# EAGLE design TeensyPedal (EAGLE 9.6.0)
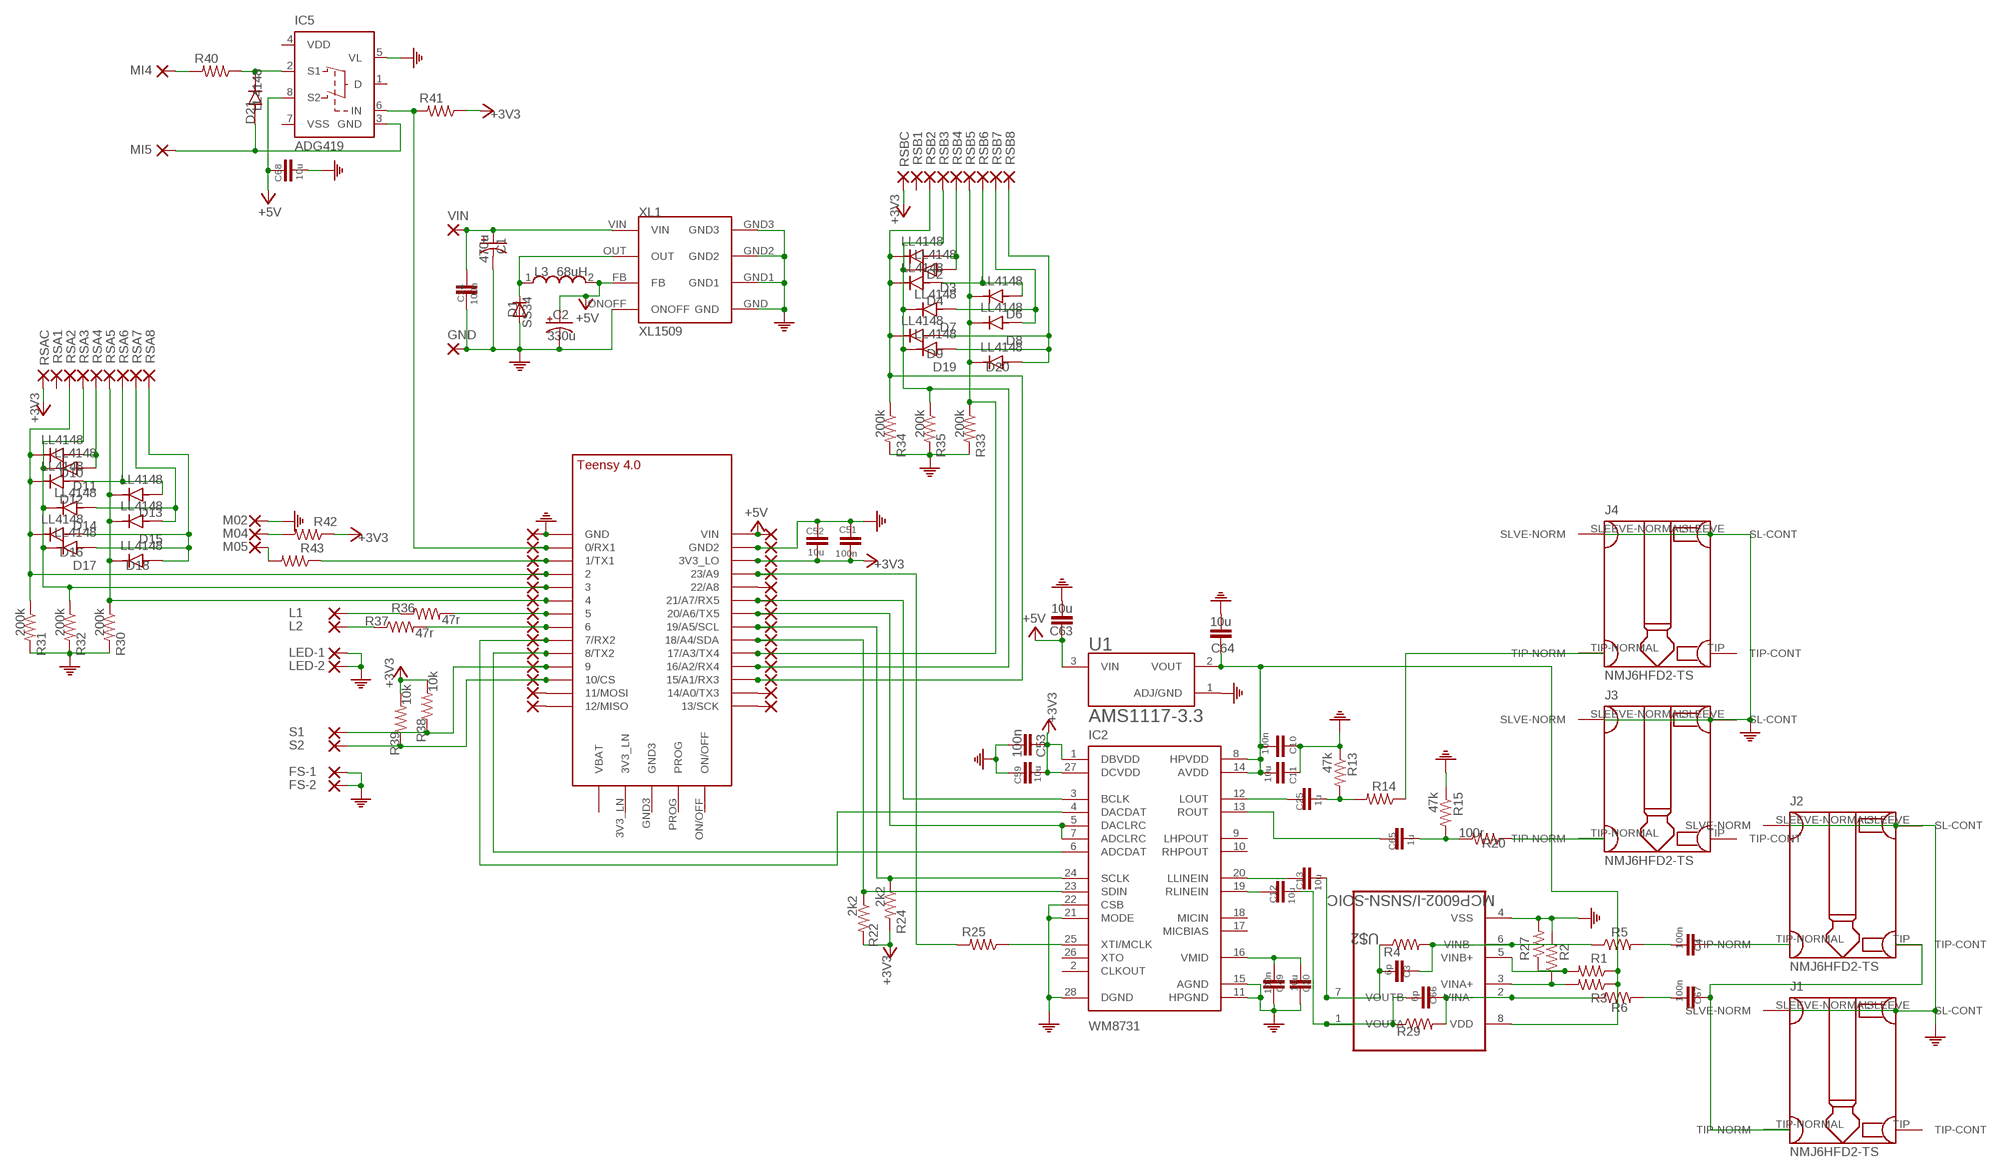
[diagram p0: schematic, sheet 1]

## Parts
+5V  1,6/0,9  [1,6/0,9]
C1  470u  CPOL-USB45181B  [B45181B]
C2  330u  CPOL-USB45181B  [B45181B]
C3  6p  C-EUC0603  [C0603]
C4  100n  C-EUC0603  [C0603]
C10  100n  C-EUC0603  [C0603]
C11  10u  C-EUC0805  [C0805]
C12  10u  C-EUC0805  [C0805]
C13  10u  C-EUC0805  [C0805]
C14  100n  C-EUC0603  [C0603]
C25  1u  C-EUC0603  [C0603]
C30  10u  C-EUC0805  [C0805]
C49  100n  C-EUC0603  [C0603]
C51  100n  C-EUC0603  [C0603]
C52  10u  C-EUC0805  [C0805]
C53  100n  C-EUC0603  [C0603]
C59  10u  C-EUC0805  [C0805]
C63  10u  C-EUC0805  [C0805]
C64  10u  C-EUC0805  [C0805]
C65  1u  C-EUC0603  [C0603]
C66  6p  C-EUC0603  [C0603]
C67  100n  C-EUC0603  [C0603]
C68  10u  C-EUC0805  [C0805]
D1  SS34  DIODE-DO214AC  [DO214AC]
D2  LL4148  [DIO_LL4148]
D3  LL4148  [DIO_LL4148]
D4  LL4148  [DIO_LL4148]
D6  LL4148  [DIO_LL4148]
D7  LL4148  [DIO_LL4148]
D8  LL4148  [DIO_LL4148]
D9  LL4148  [DIO_LL4148]
D10  LL4148  [DIO_LL4148]
D11  LL4148  [DIO_LL4148]
D12  LL4148  [DIO_LL4148]
D13  LL4148  [DIO_LL4148]
D14  LL4148  [DIO_LL4148]
D15  LL4148  [DIO_LL4148]
D16  LL4148  [DIO_LL4148]
D17  LL4148  [DIO_LL4148]
D18  LL4148  [DIO_LL4148]
D19  LL4148  [DIO_LL4148]
D20  LL4148  [DIO_LL4148]
D21  LL4148  [DIO_LL4148]
FS-1  1,6/0,9  [1,6/0,9]
FS-2  1,6/0,9  [1,6/0,9]
GND  1,6/0,9  [1,6/0,9]
GND10  2,15/1,0  [2,15/1,0]
IC2  WM8731  [SSOP28]
IC5  ADG419  [DIL08]
J1  NMJ6HFD2-TS  [NMJ6HFD2-TS]
J2  NMJ6HFD2-TS  [NMJ6HFD2-TS]
J3  NMJ6HFD2-TS  [NMJ6HFD2-TS]
J4  NMJ6HFD2-TS  [NMJ6HFD2-TS]
L1  1,6/0,9  [1,6/0,9]
L2  1,6/0,9  [1,6/0,9]
L3  68uH  WE-PD_1260/1245/1280/1210  [WE-PD_1260/1245/1280/1210]
LED-1  1,6/0,9  [1,6/0,9]
LED-2  1,6/0,9  [1,6/0,9]
M02  2,15/1,0  [2,15/1,0]
M04  2,15/1,0  [2,15/1,0]
M05  2,15/1,0  [2,15/1,0]
MI4  2,15/1,0  [2,15/1,0]
MI5  2,15/1,0  [2,15/1,0]
PIN  1,6/0,9  [1,6/0,9]
PIN1  1,6/0,9  [1,6/0,9]
PIN2  1,6/0,9  [1,6/0,9]
PIN3  1,6/0,9  [1,6/0,9]
PIN4  1,6/0,9  [1,6/0,9]
PIN5  1,6/0,9  [1,6/0,9]
PIN6  1,6/0,9  [1,6/0,9]
PIN7  1,6/0,9  [1,6/0,9]
PIN8  1,6/0,9  [1,6/0,9]
PIN9  1,6/0,9  [1,6/0,9]
PIN10  1,6/0,9  [1,6/0,9]
PIN11  1,6/0,9  [1,6/0,9]
PIN12  1,6/0,9  [1,6/0,9]
PIN13  1,6/0,9  [1,6/0,9]
PIN14  1,6/0,9  [1,6/0,9]
PIN15  1,6/0,9  [1,6/0,9]
PIN16  1,6/0,9  [1,6/0,9]
PIN17  1,6/0,9  [1,6/0,9]
PIN18  1,6/0,9  [1,6/0,9]
PIN19  1,6/0,9  [1,6/0,9]
PIN20  1,6/0,9  [1,6/0,9]
PIN21  1,6/0,9  [1,6/0,9]
PIN22  1,6/0,9  [1,6/0,9]
PIN23  1,6/0,9  [1,6/0,9]
PIN24  1,6/0,9  [1,6/0,9]
PIN25  1,6/0,9  [1,6/0,9]
R1  200k  R-US_R0603  [R0603]
R2  200k  R-US_R0603  [R0603]
R3  200k  R-US_R0603  [R0603]
R4  1m  R-US_0204/7  [0204/7]
R5  1m  R-US_R0603  [R0603]
R6  1m  R-US_R0603  [R0603]
R13  47k  R-US_R0603  [R0603]
R14  100r  R-US_R0603  [R0603]
R15  47k  R-US_R0603  [R0603]
R20  100r  R-US_R0603  [R0603]
R22  2k2  R-US_R0603  [R0603]
R24  2k2  R-US_R0603  [R0603]
R25  220r  R-US_R0603  [R0603]
R27  200k  R-US_R0603  [R0603]
R29  1m  R-US_0204/7  [0204/7]
R30  200k  R-US_R0603  [R0603]
R31  200k  R-US_R0603  [R0603]
R32  200k  R-US_R0603  [R0603]
R33  200k  R-US_R0603  [R0603]
R34  200k  R-US_R0603  [R0603]
R35  200k  R-US_R0603  [R0603]
R36  47r  R-US_R0603  [R0603]
R37  47r  R-US_R0603  [R0603]
R38  10k  R-US_R0603  [R0603]
R39  10k  R-US_R0603  [R0603]
R40  220r  R-US_R0603  [R0603]
R41  470r  R-US_R0603  [R0603]
R42  47r  R-US_R0603  [R0603]
R43  47r  R-US_R0603  [R0603]
RSA1  2,15/1,0  [2,15/1,0]
RSA2  2,15/1,0  [2,15/1,0]
RSA3  2,15/1,0  [2,15/1,0]
RSA4  2,15/1,0  [2,15/1,0]
RSA5  2,15/1,0  [2,15/1,0]
RSA6  2,15/1,0  [2,15/1,0]
RSA7  2,15/1,0  [2,15/1,0]
RSA8  2,15/1,0  [2,15/1,0]
RSAC  2,15/1,0  [2,15/1,0]
RSB1  2,54/1,1  [2,54/1,1]
RSB2  2,15/1,0  [2,15/1,0]
RSB3  2,15/1,0  [2,15/1,0]
RSB4  2,15/1,0  [2,15/1,0]
RSB5  2,15/1,0  [2,15/1,0]
RSB6  2,15/1,0  [2,15/1,0]
RSB7  2,15/1,0  [2,15/1,0]
RSB8  2,15/1,0  [2,15/1,0]
RSBC  2,15/1,0  [2,15/1,0]
S1  1,6/0,9  [1,6/0,9]
S2  1,6/0,9  [1,6/0,9]
U1  AMS1117-3.3  [SOT229P700X180-4N]
U$1  TEENSY_4.0  [TEENSY_4.0]
U$2  MCP6002-I/SNSN-SOIC  [SOIC127P690X150-8N]
VIN  2,15/1,0  [2,15/1,0]
XL1  XL1509  [XL1509]

## Nets
3V3_ANA1: C10.1 C11.1 C64.1 IC2.8(HPVDD) IC2.14(AVDD) R1.1 R3.1 U1.2(VOUT) U$2.8(VDD)
+3V3: C51.1 C52.2 C53.1 C59.2 IC2.1(DBVDD) IC2.27(DCVDD) PIN24.1(P) R22.2 R24.2 R38.2 R39.2 R41.1 R42.1 RSAC.1(P) RSBC.1(P) U$1.3V3_LO
+5V: +5V.1(P) C2.+ C63.1 C68.1 IC5.8(S2) L3.2 U1.3(VIN) U$1.VIN XL1.FB
N$1: D1.C L3.1 XL1.OUT
N$2: C30.2 C49.2 IC2.16(VMID)
N$3: IC2.24(SCLK) PIN19.1(P) R24.1 U$1.19/A5/SCL
N$4: IC2.23(SDIN) PIN18.1(P) R22.1 U$1.18/A4/SDA
N$5: C4.2 J2.TIP-NORMAL(TIP-NORM)
N$6: R1.2 R27.1 U$2.5(VINB+)
N$9: C4.1 R5.2
N$10: C12.1 C66.1 R29.1 U$2.1(VOUTA)
N$11: R2.1 R3.2 U$2.3(VINA+)
N$12: C3.2 R4.2 R5.1 U$2.6(VINB-)
N$13: C66.2 R6.1 R29.2 U$2.2(VINA-)
N$14: C3.1 C13.1 R4.1 U$2.7(VOUTB)
N$15: C67.1 R6.2
N$16: C67.2 J1.TIP-NORMAL(TIP-NORM) J2.TIP(TIP-CONT)
N$17: PIN13.1(P) U$1.13/SCK
N$18: IC2.5(DACLRC) IC2.7(ADCLRC) PIN20.1(P) U$1.20/A6(20/A6/TX5)
N$19: PIN14.1(P) U$1.14/A0(14/A0/TX3)
N$22: C25.1 R13.2 R14.2
N$23: C25.2 IC2.12(LOUT)
N$24: J4.TIP-NORMAL(TIP-NORM) R14.1
N$25: C65.1 R15.2 R20.2
N$26: J3.TIP-NORMAL(TIP-NORM) R20.1
N$28: C65.2 IC2.13(ROUT)
N$29: IC2.4(DACDAT) PIN7.1(P) U$1.7(7/RX2)
N$30: IC2.6(ADCDAT) PIN8.1(P) U$1.8(8/TX2)
N$31: IC2.3(BCLK) PIN21.1(P) U$1.21/A7(21/A7/RX5)
N$32: PIN23.1(P) R25.2 U$1.23/A9
N$33: IC2.25(XTI/MCLK) R25.1
N$43: C13.2 IC2.20(LLINEIN)
N$44: D10.A D11.A RSA4.1(P)
N$45: C12.2 IC2.19(RLINEIN)
N$47: D12.A D13.A RSA6.1(P)
N$48: D14.A D15.A RSA7.1(P)
N$49: D16.A D17.A D18.A RSA8.1(P)
N$50: IC5.6(IN) PIN.1(P) R41.2 U$1.0/RX(0/RX1)
N$51: PIN1.1(P) R43.1 U$1.1/TX(1/TX1)
N$52: PIN5.1(P) R36.2 U$1.5
N$55: PIN6.1(P) R37.2 U$1.6
N$56: D21.C IC5.2(S1) R40.1
N$57: D21.A IC5.3(GND) MI5.1(P)
N$58: PIN11.1(P) U$1.11/MOSI
N$59: PIN12.1(P) U$1.12/MISO
N$60: L1.1(P) R36.1
N$61: L2.1(P) R37.1
N$62: MI4.1(P) R40.2
N$65: PIN22.1(P) U$1.22/A8
N$66: D2.A D3.A RSB4.1(P)
N$67: D4.A D6.A RSB6.1(P)
N$68: D7.A D8.A RSB7.1(P)
N$69: D9.A D19.A D20.A RSB8.1(P)
N$70: PIN9.1(P) R38.1 S1.1(P) U$1.9/CS
N$71: PIN10.1(P) R39.1 S2.1(P) U$1.10/CS
N$72: M04.1(P) R42.2
N$73: M05.1(P) R43.2
PE: C1.- C2.- C10.2 C11.2 C14.1 C30.1 C49.1 C51.2 C52.1 C53.2 C59.1 C63.2 C64.2 C68.2 D1.A FS-1.1(P) FS-2.1(P) GND10.1(P) GND.1(P) IC2.11(HPGND) IC2.15(AGND) IC2.21(MODE) IC2.22(CSB) IC2.28(DGND) IC5.5(VL) J1.SLEEVE(SL-CONT) J1.SLEEVE-NORMAL(SLVE-NORM) J2.SLEEVE(SL-CONT) J2.SLEEVE-NORMAL(SLVE-NORM) J3.SLEEVE(SL-CONT) J3.SLEEVE-NORMAL(SLVE-NORM) J4.SLEEVE(SL-CONT) J4.SLEEVE-NORMAL(SLVE-NORM) LED-1.1(P) LED-2.1(P) M02.1(P) PIN25.1(P) R2.2 R13.1 R15.1 R27.2 R30.2 R31.2 R32.2 R33.2 R34.2 R35.2 U1.1(ADJ/GND) U$1.GND U$1.GND2 U$2.4(VSS) XL1.GND XL1.GND1 XL1.GND2 XL1.GND3 XL1.ONOFF
RSW1: D10.C D12.C D16.C PIN2.1(P) R31.1 RSA2.1(P) U$1.2
RSW2: D11.C D14.C D17.C PIN3.1(P) R32.1 RSA3.1(P) U$1.3/CANTX
RSW3: D13.C D15.C D18.C PIN4.1(P) R30.1 RSA5.1(P) U$1.4/CANRX
RSW4: D6.C D8.C D20.C PIN17.1(P) R33.1 RSB5.1(P) U$1.17/A3(17/A3/TX4)
RSW5: D3.C D7.C D19.C PIN16.1(P) R35.1 RSB3.1(P) U$1.16/A2(16/A2/RX4)
RSW6: D2.C D4.C D9.C PIN15.1(P) R34.1 RSB2.1(P) U$1.15/A1(15/A1/RX3)
VIN: C1.+ C14.2 VIN.1(P) XL1.VIN
Unconnected: IC2.2(CLKOUT) IC2.9(LHPOUT) IC2.10(RHPOUT) IC2.17(MICBIAS) IC2.18(MICIN) IC2.26(XTO) IC5.1(D) J1.TIP(TIP-CONT) J3.TIP(TIP-CONT) J4.TIP(TIP-CONT) RSA1.1(P) RSB1.1(P) U$1.3V3_LN U$1.GND3 U$1.ON/OFF U$1.PROG U$1.VBAT\(VBAT)

## Power pins joined to a net without a drawn wire
VDD: IC5.4(VDD)
VSS: IC5.7(VSS)

## Library data of the parts
+5V FS-1 FS-2 GND L1 L2 LED-1 LED-2 PIN PIN1-PIN25 S1 S2 = wirepad:1,6/0,9: THROUGH-HOLE PAD
C1 C2 = rcl:CPOL-US: POLARIZED CAPACITOR, American symbol; SPICEPREFIX: C
C3 C4 C10-C14 C25 C30 C49 C51-C53 C59 C63-C68 = rcl:C-EU: CAPACITOR, European symbol
D1 = diode:DIODE-: DIODE
D2-D4 D6-D21 = LL4148:LL4148: Surface Mount Switching Glass; AVAILABILITY: Unavailable; DESCRIPTION: Diode Standard 100V 200mA Surface Mount SOD-80; MF: ON Semiconductor; MP: LL4148; PACKAGE: SOD-80 Taitron; PRICE: None
GND10 M02 M04 M05 MI4 MI5 RSA1-RSA8 RSAC RSB2-RSB8 RSBC VIN = wirepad:2,15/1,0: THROUGH-HOLE PAD
IC2 = og-dac:WM8731
IC5 = analog-devices:ADG419: LC²MOS Precision Mini-DIP Analog switch Source: http://www.analog.com/UploadedFiles/Data_Sheets/ADG419.pdf; MF: ALTERA CORPORATION; MPN: ADG419BN; OC_FARNELL: 1438705; OC_NEWARK: 16F6524
J1-J4 = NMJ6HFD2:NMJ6HFD2-TS
L3 = Wurth_Elektronik_Passive_rev15e:WE-PD: SMD Shielded Power Inductor Characteristics Magnetically shielded version which results in a low leakage field High Saturation currents up to 25 A Very low self-losses at high switching frequency‘s Wide inductances spectrum available at all sizes Operating temperature: –40 °C to +125 °C Applications Perfectly suitable for switching regulators with extremely high efficiency Integrated DC/DC- converter Switching regulators with low operating voltages (Graphic cards, embedded PC-Cards, Mainboards) Plastic base: Because of the one piece construction these are more suitable for high vibration or shock applications <http://katalog.we-online.de/media/images/eisos/FePBF_pf2.jpg> Details see: http://katalog.we-online.de/en/pbs/WE-PD? Updated by Dan Xu 2014-07-08 2014 (C) Wurth Elektronik
R1-R6 R13-R15 R20 R22 R24 R25 R27 R29-R43 = rcl:R-US_: RESISTOR, American symbol
RSB1 = wirepad:2,54/1,1: THROUGH-HOLE PAD
U1 = AMS1117-3.3:AMS1117-3.3: Sot223/Pkg 1-Amp 3.3-Volt Low Drop Out Voltage Regulatator; AVAILABILITY: Unavailable; DESCRIPTION: Sot223/Pkg 1-Amp 3.3-Volt Low Drop Out Voltage Regulatator; MF: Advanced Monolithic Systems; MP: AMS1117-3.3; PACKAGE: None; PRICE: None
U$1 = TEENSY 4.0:TEENSY_4.0
U$2 = MCP6002-I_MS:MCP6002-I/SN: Low-Power Op Amp Check prices <https://pricing.snapeda.com/parts/MCP6002-I/MS/Microchip/view-part?ref=eda>
XL1 = XL1509:XL1509

## Net classes
3 vcc: width 0.508 mm, drill 0.61 mm, clearance 0.254 mm

## Board
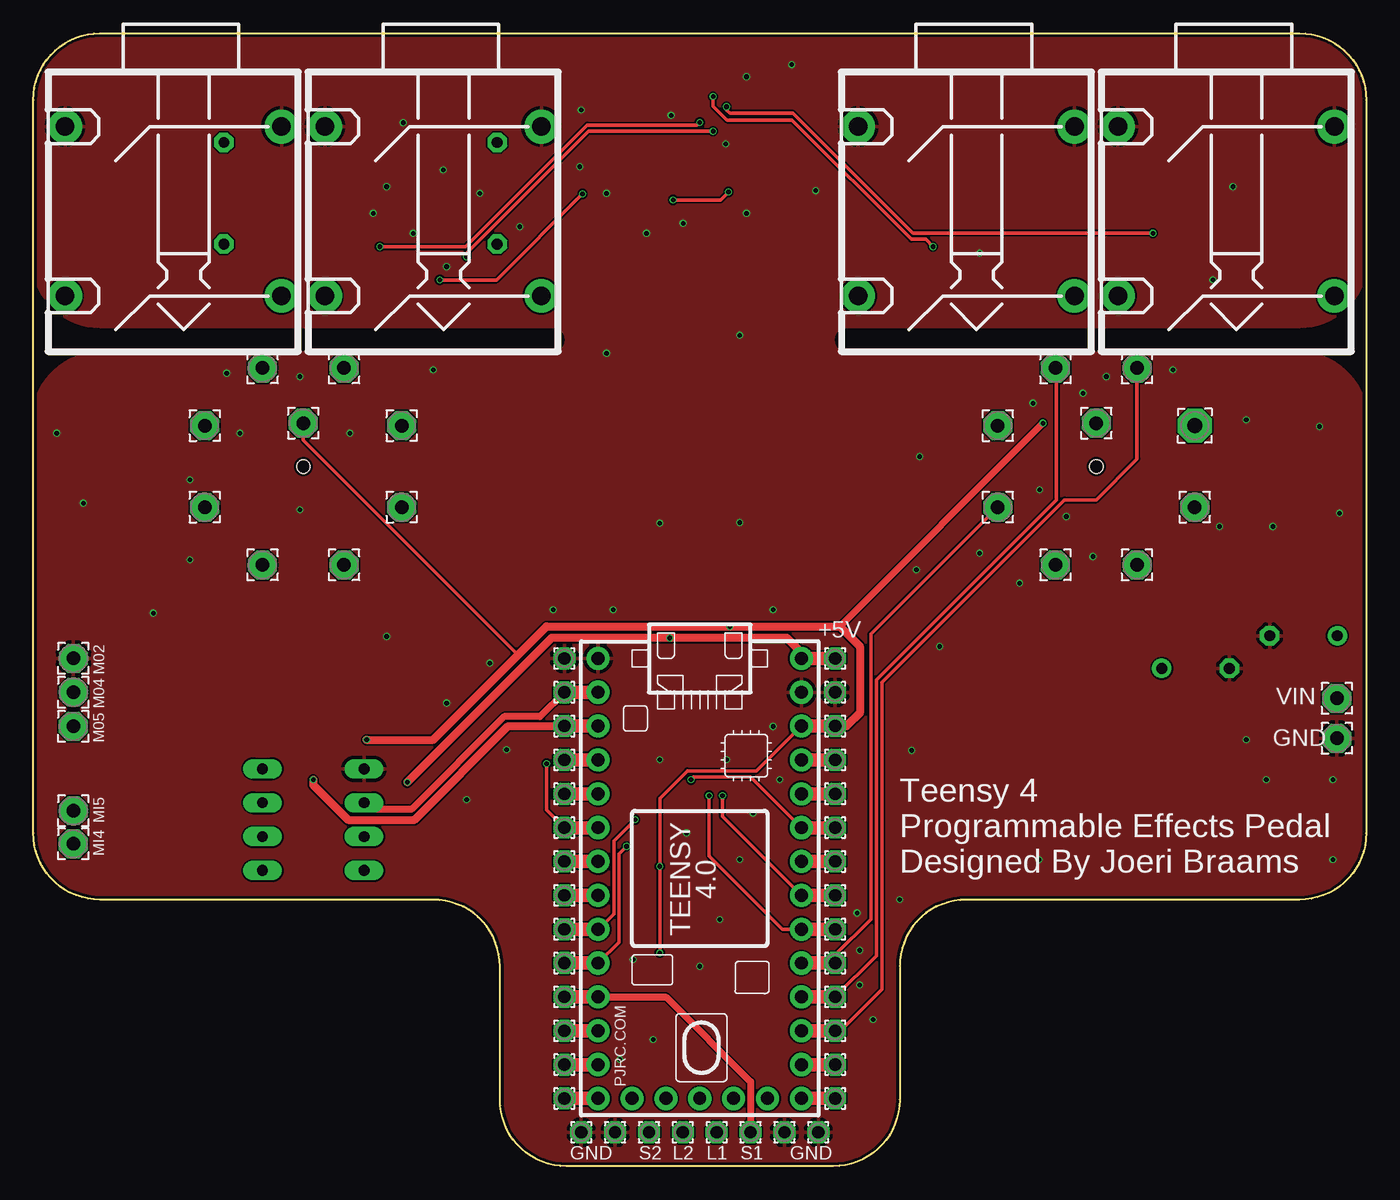
[diagram p1: board, top side]
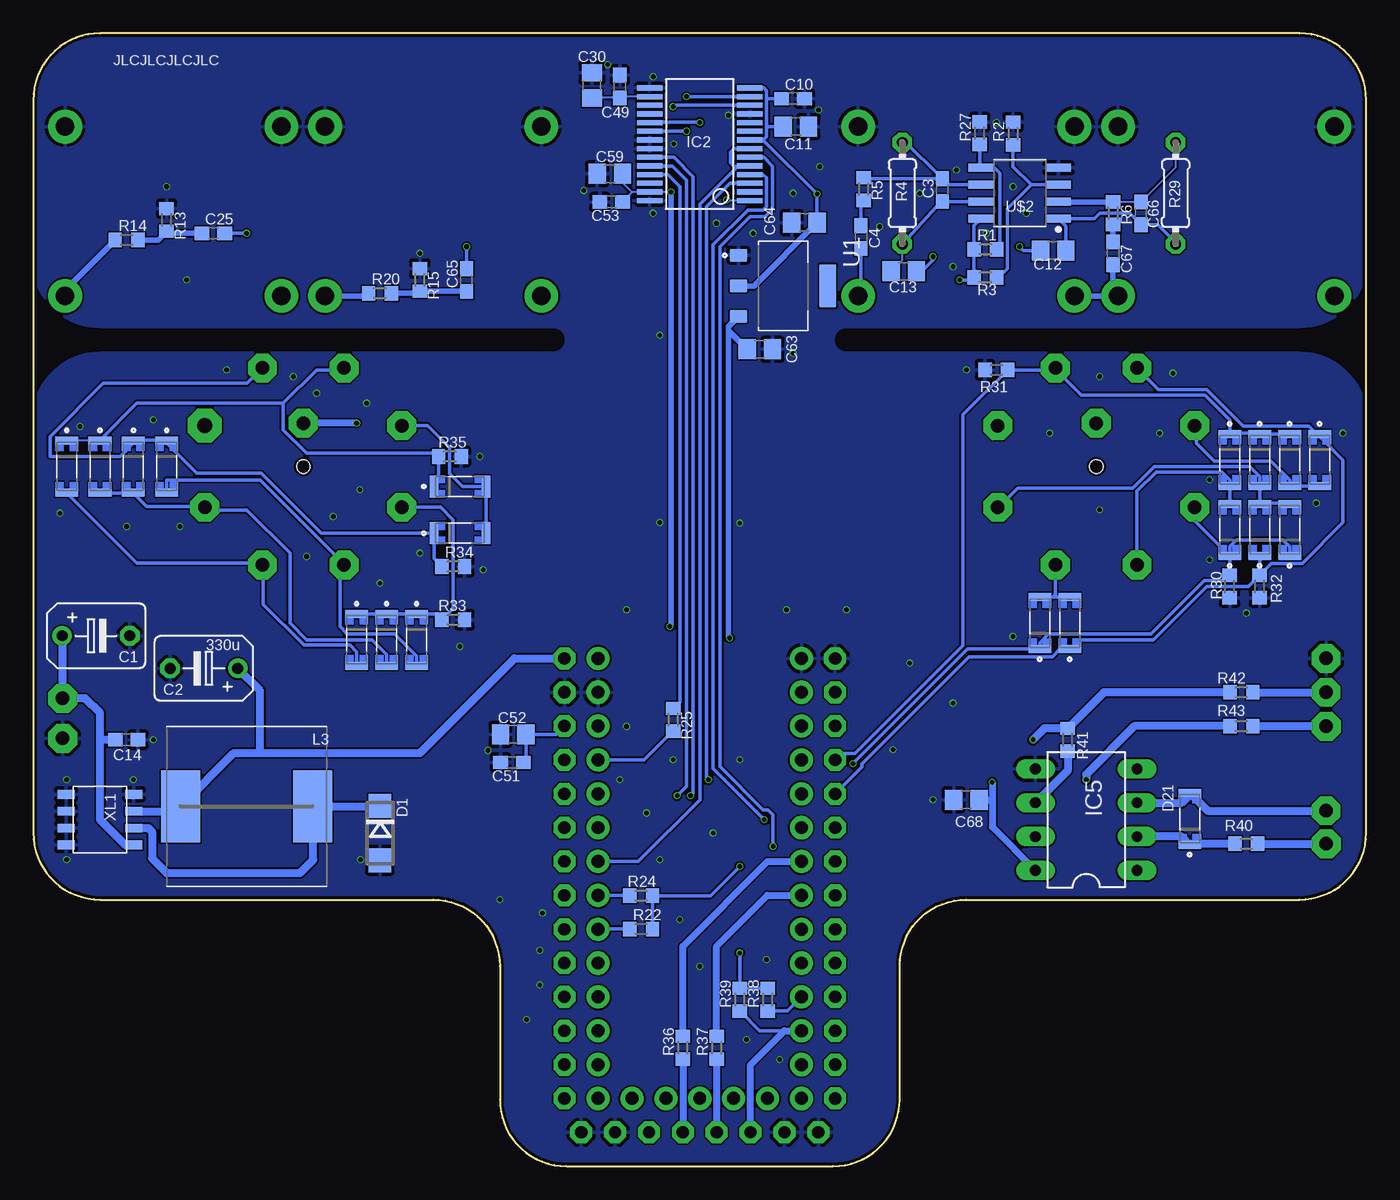
[diagram p2: board, bottom side, seen from below]

Size 100 x 85 mm. Coordinates in mm from the lower left corner, seen from the top.
Outline: 5,85 95,85 arc-90 100,80 100,25 arc-90 95,20 70,20 arc90 65,15 65,5 arc-90 60,0 40,0 arc-90 35,5 35,15 arc90 30,20 5,20 arc-90 0,25 0,80 arc-90 5,85
Copper layers (1*16): Top 0.035mm / dielectric 1.6mm / Bottom 0.035mm
Design rules "jlcpcb-2layers *": minimum track width 5mil, minimum drill 0.3mm, track to track 5mil, track to pad 5mil, pad to pad 5mil, via to via 5mil, smd to smd 5mil, copper to edge 0.2mm, drill to drill 6mil, minimum pad ring 10mil, minimum via ring 3mil, stop-mask expansion 4mil, vias tented up to drill 0.4mm, thermal gap 10mil
Holes 1 mm at 20.25,52.5 79.75,52.5

### Footprints (pad centres in the part's own frame; a part is rotated, then mirrored left to right if it is on the bottom)
1,6/0,9 = drill 0.914 pad 1.6 octagon: 1 0,0
B45181B = drill 0.813: + -2.54,0 | drill 0.813 octagon: - 2.54,0
C0603 = smd 1.1 x 1: 1 -0.85,0; 2 0.85,0
C0805 = smd 1.3 x 1.5: 1 -0.95,0; 2 0.95,0
DO214AC = smd 1.8 x 1.7: A 2.05,0; C -2.05,0
DIO_LL4148 = smd 0.6 x 1.65: A 1.95,0; C -1.95,0
2,15/1,0 = drill 1.016 pad 2.159 octagon: 1 0,0
SSOP28 = smd 0.381 x 1.905: 1 -4.55,-3.752; 2 -3.9,-3.752; 3 -3.25,-3.752; 4 -2.6,-3.752; 5 -1.95,-3.752; 6 -1.3,-3.752; 7 -0.65,-3.752; 8 0,-3.752; 9 0.65,-3.752; 10 1.3,-3.752; 11 1.95,-3.752; 12 2.6,-3.752; 13 3.25,-3.752; 14 3.9,-3.752; 15 3.9,3.752; 16 3.25,3.752; 17 2.6,3.752; 18 1.95,3.752; 19 1.3,3.752; 20 0.65,3.752; 21 0,3.752; 22 -0.65,3.752; 23 -1.3,3.752; 24 -1.95,3.752; 25 -2.6,3.752; 26 -3.25,3.752; 27 -3.9,3.752; 28 -4.55,3.752
DIL08 = drill 0.813 long: 1 -3.81,-3.81; 2 -1.27,-3.81; 3 1.27,-3.81; 4 3.81,-3.81; 5 3.81,3.81; 6 1.27,3.81; 7 -1.27,3.81; 8 -3.81,3.81
NMJ6HFD2-TS = drill 1.397 pad 2.54: SLEEVE 0,-8.115; SLEEVE-NORMAL 0,8.115; TIP 12.7,-8.115; TIP-NORMAL 12.7,8.115
WE-PD_1260/1245/1280/1210 = smd 2.9 x 5.4: 1 -4.95,0; 2 4.95,0
R0603 = smd 1 x 1.1: 1 -0.85,0; 2 0.85,0
0204/7 = drill 0.813 octagon: 1 -3.81,0; 2 3.81,0
2,54/1,1 = drill 1.118 pad 2.54 octagon: 1 0,0
SOT229P700X180-4N = smd 0.93 x 1.31: 1 -2.29,-3.345; 2 0,-3.345; 3 2.29,-3.345 | smd 3.24 x 1.31: 4 0,3.345
TEENSY_4.0 = drill 0.965: 0/RX -13.97,-7.62; 1/TX -11.43,-7.62; 2 -8.89,-7.62; 3/CANTX -6.35,-7.62; 3V3_LN 16.51,-2.54; 3V3_LO -11.43,7.62; 4/CANRX -3.81,-7.62; 5 -1.27,-7.62; 6 1.27,-7.62; 7 3.81,-7.62; 8 6.35,-7.62; 9/CS 8.89,-7.62; 10/CS 11.43,-7.62; 11/MOSI 13.97,-7.62; 12/MISO 16.51,-7.62; 13/SCK 16.51,7.62; 14/A0 13.97,7.62; 15/A1 11.43,7.62; 16/A2 8.89,7.62; 17/A3 6.35,7.62; 18/A4/SDA 3.81,7.62; 19/A5/SCL 1.27,7.62; 20/A6 -1.27,7.62; 21/A7 -3.81,7.62; 22/A8 -6.35,7.62; 23/A9 -8.89,7.62; GND -16.51,-7.62; GND2 -13.97,7.62; GND3 16.51,0; ON/OFF 16.51,5.08; PROG 16.51,2.54; VBAT\ 16.51,-5.08; VIN -16.51,7.62
SOIC127P690X150-8N = smd 1.901 x 0.602: 1 -2.905,1.905; 2 -2.905,0.635; 3 -2.905,-0.635; 4 -2.905,-1.905; 5 2.905,-1.905; 6 2.905,-0.635; 7 2.905,0.635; 8 2.905,1.905
XL1509 = smd 1.27 x 0.66: FB -2.54,-0.635; GND 2.54,-1.905; GND1 2.54,-0.635; GND2 2.54,0.635; GND3 2.54,1.905; ONOFF -2.54,-1.905; OUT -2.54,0.635; VIN -2.54,1.905

### Placement (x,y rotation side)
+5V  60.16,38.1 0 top
C1  95.3,39.8 0 bottom
C2  87.2,37.35 180 bottom
C3  31.8,73.24 90 bottom
C4  37.9,69.72 270 bottom
C10  43,80.1 0 bottom
C11  42.8,78 0 bottom
C12  23.49,68.7 180 bottom
C13  34.7,67.15 0 bottom
C14  93,32 180 bottom
C25  86.5,70 0 bottom
C30  58.1,81.1 270 bottom
C49  56,81 270 bottom
C51  64.1,30.3 180 bottom
C52  64,32.4 0 bottom
C53  56.65,72.35 180 bottom
C59  56.75,74.45 0 bottom
C63  45.5,61.3 0 bottom
C64  42.15,70.8 180 bottom
C65  67.5,66.5 90 bottom
C66  16.9,71.5 90 bottom
C67  19,68.5 270 bottom
C68  30,27.5 180 bottom
D1  74,25 270 bottom
D2  68,47.5 0 bottom
D3  68,51 0 bottom
D4  90,52.5 270 bottom
D6  71.25,39.5 270 bottom
D7  97.5,52.5 270 bottom
D8  75.75,39.5 270 bottom
D9  92.5,52.5 270 bottom
D10  5.75,53 270 bottom
D11  3.5,53 270 bottom
D12  10.25,53 270 bottom
D13  10.25,47.75 90 bottom
D14  22.25,40.75 90 bottom
D15  24.5,40.75 90 bottom
D16  8,53 270 bottom
D17  8,47.75 90 bottom
D18  5.75,47.75 90 bottom
D19  95,52.5 270 bottom
D20  73.5,39.5 270 bottom
D21  13.24,26.07 90 bottom
FS-1  58.89,2.54 0 top
FS-2  41.11,2.54 0 top
GND  39.84,38.1 0 top
GND10  97.8,32.1 0 top
IC2  50,77 90 bottom
IC5  21,26 90 bottom
J1  10.5,78 270 top
J2  30,78 270 top
J3  70,78 270 top
J4  89.5,78 270 top
L1  51.27,2.54 0 top
L2  48.73,2.54 0 top
L3  84,27 180 bottom
LED-1  56.35,2.54 0 top
LED-2  43.65,2.54 0 top
M02  3.01,38.1 270 top
M04  3.01,35.56 270 top
M05  3,33 270 top
MI4  3,24.19 270 top
MI5  3.01,26.67 270 top
PIN  39.84,35.56 0 top
PIN1  39.84,33.02 0 top
PIN2  39.84,30.48 0 top
PIN3  39.84,27.94 0 top
PIN4  39.84,25.4 0 top
PIN5  39.84,22.86 0 top
PIN6  39.84,20.32 0 top
PIN7  39.84,17.78 0 top
PIN8  39.84,15.24 0 top
PIN9  39.84,12.7 0 top
PIN10  39.84,10.16 0 top
PIN11  39.84,7.62 0 top
PIN12  39.84,5.08 0 top
PIN13  60.16,5.08 0 top
PIN14  60.16,7.62 0 top
PIN15  60.16,10.16 0 top
PIN16  60.16,12.7 0 top
PIN17  60.16,15.24 0 top
PIN18  60.16,17.78 0 top
PIN19  60.16,20.32 0 top
PIN20  60.16,22.86 0 top
PIN21  60.16,25.4 0 top
PIN22  60.16,27.94 0 top
PIN23  60.16,30.48 0 top
PIN24  60.16,33.02 0 top
PIN25  60.16,35.56 0 top
R1  28.57,68.8 0 bottom
R2  26.5,77.48 90 bottom
R3  28.57,66.7 0 bottom
R4  34.8,73 90 bottom
R5  37.7,73.32 270 bottom
R6  19,71.5 270 bottom
R13  90,71 270 bottom
R14  93,69.5 0 bottom
R15  71,66.5 270 bottom
R20  74,65.5 0 bottom
R22  54.4,17.8 0 bottom
R24  54.4,20.3 0 bottom
R25  52,33.5 270 bottom
R27  29,77.5 90 bottom
R29  14.3,73 90 bottom
R30  10.25,43.5 270 bottom
R31  27.75,59.75 180 bottom
R32  8,43.5 270 bottom
R33  68.5,41 0 bottom
R34  68.5,45 0 bottom
R35  68.75,53.25 0 bottom
R36  51.27,8.89 90 bottom
R37  48.73,8.89 90 bottom
R38  44.9,12.5 90 bottom
R39  47,12.5 90 bottom
R40  9,24.19 0 bottom
R41  22.4,32 270 bottom
R42  9.36,35.56 0 bottom
R43  9.36,33.02 0 bottom
RSA1  27.64,55.56 0 top
RSA2  23.31,59.89 0 top
RSA3  17.19,59.89 0 top
RSA4  12.86,55.56 0 top
RSA5  12.86,49.44 0 top
RSA6  17.19,45.11 0 top
RSA7  23.31,45.11 0 top
RSA8  27.64,49.44 0 top
RSAC  20.25,55.75 0 top
RSB1  87.14,55.56 0 top
RSB2  82.81,59.89 0 top
RSB3  76.69,59.89 0 top
RSB4  72.36,55.56 0 top
RSB5  72.36,49.44 0 top
RSB6  76.69,45.11 0 top
RSB7  82.81,45.11 0 top
RSB8  87.14,49.44 0 top
RSBC  79.75,55.75 0 top
S1  53.81,2.54 0 top
S2  46.19,2.54 0 top
U1  43.75,66.05 270 bottom
U$1  50,21.59 270 top
U$2  26,73 180 bottom
VIN  97.8,35.1 0 top
XL1  95,26 180 bottom

### Tracks (layer width: path | path; a pad name or v marks a point on that pad's centre or on a via)
3V3_ANA1  (via drill 0.35)
  Top 0.254: v30.5,66.5 34.75,66.5 v41.2,72.95
  Bottom 0.254: IC2.14 45.2,80.9 45,80.7 45,80.1 | 45,80.1 45,78 | 45,78 45,77.25 45.25,77 | 45.25,77 IC2.8 | C10.1 45,80.1 | C11.1 45,78 | U$2.8 29.41,70.58 R1.1 R3.1 29.62,66.5 v30.5,66.5 | C64.1 v41.2,72.95 45.25,77
  Bottom 0.406: U1.2 45.95,66.05 C64.1
+3V3  (via drill 0.35)
  Top 0.254: U$1.3V3_LO 54.26,29.66 49.07,29.66 47,27.59 v47,22.5 v47,16 | v52.16,73.1 51.56,72.5 v48,72.5 | RSAC.1 20.25,54.5 36.38,38.38
  Top 0.508: 60.5,40.5 v75.75,55.75
  Top 0.61: v25,32 30,32 36.38,38.38 38.5,40.5 v52.25,40.5 60.5,40.5 62,39 62,34 61.02,33.02 60,33.02
  Top 1.016: U$1.3V3_LO 60,33.02 PIN24.1
  Bottom 0.152: v52.16,73.1 IC2.27 55.05,73.1 55.08,73.08 | 55.08,73.08 C53.1 | 55.08,73.08 55.8,73.8 C59.2 | IC2.1 47.95,72.45 v48,72.5
  Bottom 0.254: R38.2 R39.2 v47,16 | C51.1 63.05,30.5 C52.2 60.78,32.4 PIN24.1 | R22.2 R24.2 49.2,20.3 v47,22.5
  Bottom 0.406: v52.16,73.1 52.16,40.59 v52.25,40.5
  Bottom 0.508: v75.75,55.75 RSBC.1
  Bottom 0.61: R42.1 19.69,35.56 R41.1 24.15,32.85 v25,32
+5V  (via drill 0.35)
  Top 0.61: U$1.VIN 57.62,38.55 56.53,39.64 v47.75,39.64 38.89,39.64 v28.06,28.81
  Top 1.016: U$1.VIN +5V.1
  Bottom 0.406: 47.85,62.7 47.85,39.79 47.75,39.69 v47.75,39.64 | U1.3 47.85,63.01 47.85,62.7 | C63.1 47.85,62.7
  Bottom 0.508: v28.06,28.81 28.06,27.5 | 28.06,27.5 28.06,25.44 IC5.8 | C68.1 28.06,27.5
  Bottom 0.61: XL1.FB 89.31,26.64 L3.2 84.95,31 83,31 | +5V.1 63.9,38.1 71,31 83,31 | 83,31 83,35.69 C2.+
N$1
  Bottom 0.61: XL1.OUT 91.37,25.36 91.1,25.1 91.1,23.1 90,22 80,22 79,23 79,26.95 L3.1 74.05,27 D1.C
N$2
  Bottom 0.152: IC2.16 55.9,80.25 C49.2 C30.2
N$3  (via drill 0.35)
  Top 0.254: U$1.19/A5/SCL 51.7,26.24 v51.7,27.8
  Top 1.016: U$1.19/A5/SCL PIN19.1
  Bottom 0.254: v51.7,27.8 51,28.5 51,74 52.05,75.05 IC2.24 | R24.1 55.27,20.32 U$1.19/A5/SCL
N$4  (via drill 0.35)
  Top 0.254: v50.7,27.8 50.7,23.3 56.22,17.78 U$1.18/A4/SDA
  Top 1.016: U$1.18/A4/SDA PIN18.1
  Bottom 0.254: IC2.23 51.95,75.7 50.5,74.25 50.5,28 v50.7,27.8 | R22.1 57.6,17.8 U$1.18/A4/SDA
N$5
  Bottom 0.254: J2.TIP-NORMAL 37.9,65.51 C4.2
N$6
  Bottom 0.254: R27.1 29,75 U$2.5 27.91,74.91 27.5,74.5 27.5,69.01 R1.2
N$9
  Bottom 0.254: C4.1 37.9,72.27 R5.2
N$10
  Bottom 0.254: R29.1 14.3,69.3 15.65,70.65 C66.1 17.75,71.5 20,71.5 20.41,71.09 U$2.1 22.54,70.54 C12.1
N$11
  Bottom 0.254: U$2.3 25.14,73.64 | R2.1 26.5,75 25.14,73.64 | R3.2 27.57,66.7 26.94,67.33 26.94,71.83 25.14,73.64
N$12
  Bottom 0.254: U$2.6 31.34,73.64 C3.2 | C3.2 34.78,77.07 R4.2 | R5.1 37.62,74.09 C3.2
N$13
  Bottom 0.152: R29.2 14.3,74.95 C66.2 R6.1
  Bottom 0.406: R6.1 U$2.2
N$14
  Bottom 0.152: C13.1 34.8,68 R4.1
  Bottom 0.254: R4.1 31.86,72.39 C3.1 31.77,72.36 U$2.7
N$15
  Bottom 0.406: C67.1 R6.2
N$16
  Bottom 0.406: J2.TIP J1.TIP-NORMAL 19,65.69 C67.2
N$17
  Top 1.016: PIN13.1 U$1.13/SCK
N$18
  Top 1.016: U$1.20/A6 PIN20.1
  Bottom 0.254: IC2.7 47.45,76.35 47.7,76.1 47.7,75.3 47.45,75.05 IC2.5 47.14,75.05 50,72.19 50,27.5 54.64,22.86 U$1.20/A6
N$19
  Top 1.016: PIN14.1 U$1.14/A0
N$22
  Bottom 0.406: R14.2 90.65,69.5 R13.2 89.85,70 C25.1
N$23  (via drill 0.35)
  Top 0.254: v84,70 66,70 57,79 52.25,79 52,79.25 v52,79.5
  Bottom 0.254: C25.2 v84,70 | IC2.12 51.9,79.6 v52,79.5
N$24
  Bottom 0.406: J4.TIP-NORMAL 97.62,65.73 R14.1
N$25
  Bottom 0.406: R20.2 71.15,65.5 R15.2 C65.1
N$26
  Bottom 0.406: J3.TIP-NORMAL 75.05,65.3 R20.1
N$28  (via drill 0.35)
  Top 0.254: v51,80.26 51,79.55 52.05,78.5 56.92,78.5 65.88,69.55 66.95,69.55 v67.5,69
  Bottom 0.254: v67.5,69 C65.2 | IC2.13 v50.99,80.25 v51,80.26
N$29  (via drill 0.35)
  Top 0.254: U$1.7 43.55,18.95 43.55,24.39 v45.16,26
  Top 1.016: PIN7.1 U$1.7
  Bottom 0.254: v45.16,26 49,29.84 49,69.15 46.4,71.75 45.25,71.75 45,72 45,74.15 45.25,74.4 IC2.4
N$30  (via drill 0.35)
  Top 0.254: v44.5,24 43.95,23.45 43.95,16.81 U$1.8
  Top 1.016: PIN8.1 U$1.8
  Bottom 0.254: IC2.6 45.2,75.7 44.55,75.05 44.55,71.8 45.1,71.25 46.25,71.25 48.5,69 48.5,30 45.25,26.75 44.9,26.75 44.5,26.35 v44.5,24
N$31  (via drill 0.35)
  Top 0.254: v49.34,29 49.54,29.2 53.82,29.2 U$1.21/A7
  Top 1.016: U$1.21/A7 PIN21.1
  Bottom 0.254: IC2.3 47.75,73.75 49.5,72 49.5,29.16 v49.34,29
N$32
  Top 1.016: U$1.23/A9 PIN23.1
  Bottom 0.254: R25.2 54.17,30.48 U$1.23/A9
N$33
  Bottom 0.254: R25.1 51.5,34.85 51.5,73.5 52.4,74.4 IC2.25
N$43  (via drill 0.35)
  Top 0.254: v32.5,68.25 32.56,68.31 32.56,68.54 41.67,77.66 v51,77.66
  Bottom 0.254: C13.2 33.35,67.15 32.5,68 v32.5,68.25 | v51,77.66 v51.01,77.65 IC2.20
N$44
  Bottom 0.152: 5.75,51 D10.A
  Bottom 0.254: D11.A 5.7,51.05 5.75,51 | RSA4.1 12.75,55.45 12.75,54.25 11.4,52.9 7.15,52.9 5.75,51.5 D10.A
N$45  (via drill 0.35)
  Top 0.254: v26,69 32.44,69 41.56,78.11 49.8,78.11 v50,78.31
  Bottom 0.254: C12.2 25.7,68.7 v26,69 | v50,78.31 53.74,78.31 IC2.19
N$47
  Bottom 0.254: RSA6.1 17.19,50.66 15.75,52.09 10.84,52.09 10.25,51.5 D12.A D13.A
N$48
  Bottom 0.254: D14.A 23.5,42.7 | 23.5,42.7 D15.A | 23.5,42.7 23.31,42.89 RSA7.1
N$49
  Bottom 0.152: 8,51 D16.A | 27.75,49.25 RSA8.1
  Bottom 0.254: D17.A 8,49.75 | 8,49.75 8,51 | D16.A 8,51.75 8.75,52.5 15.88,52.5 17.51,50.88 26.12,50.88 27.75,49.25 | D18.A 5.8,49.75 8,49.75
N$50
  Top 0.508: PIN.1 38.01,33.73 35.33,33.73 28.36,26.77 25.31,26.77 IC5.6
  Top 1.016: U$1.0/RX PIN.1
  Bottom 0.61: R41.2 22.4,29.68 IC5.6
N$51  (via drill 0.35)
  Top 0.61: v21,29 21,28.6 23.6,26 28.6,26 35.62,33.02 PIN1.1
  Top 1.016: U$1.1/TX PIN1.1
  Bottom 0.61: R43.1 17.38,33.02 21,29.4 v21,29
N$52
  Top 1.016: PIN5.1 U$1.5
  Bottom 0.508: R36.2 51.27,16.51 44.92,22.86 U$1.5
N$55
  Top 1.016: PIN6.1 U$1.6
  Bottom 0.508: R37.2 48.73,16.51 44.92,20.32 U$1.6
N$56
  Bottom 0.61: R40.1 13.17,24.19 D21.C 13.85,24.73 IC5.2
N$57
  Bottom 0.61: D21.A 13.16,27.95 | 13.16,27.95 11.89,26.67 MI5.1 | IC5.3 13.84,27.27 13.16,27.95
N$58
  Top 1.016: PIN11.1 U$1.11/MOSI
N$59
  Top 1.016: PIN12.1 U$1.12/MISO
N$60
  Bottom 0.508: R36.1 L1.1
N$61
  Bottom 0.508: R37.1 L2.1
N$62
  Bottom 0.61: R40.2 MI4.1
N$65
  Top 1.016: U$1.22/A8 PIN22.1
N$66
  Bottom 0.254: D2.A D3.A 67.8,51 68.77,51.97 68.77,53.92 70.42,55.56 RSB4.1
N$67
  Bottom 0.254: D4.A 90,51.5 83,51.5 76.69,45.19 RSB6.1 77,44.8 77,40.5 76.45,39.95 72.9,39.95 71.25,38.3 D6.A
N$68
  Bottom 0.152: 82.75,45 RSB7.1 | 97.5,50.5 D7.A
  Bottom 0.254: 82.75,45 82.75,42.15 79.69,39.09 76.25,39.09 75.75,38.59 D8.A | 97.5,50.5 92.25,45.25 83,45.25 RSB7.1
N$69
  Bottom 0.152: 95,50.5 D19.A | 87,49.25 RSB8.1 87.25,49.5
  Bottom 0.254: 92.5,50.5 D9.A | 95,50.5 92.5,50.5 | 87,49.25 84,49.25 80.75,46 80.75,40.75 79.5,39.5 74.6,39.5 73.5,38.4 D20.A | 92.5,50.5 91.5,49.5 87.25,49.5
N$70
  Top 0.508: U$1.9/CS 47.46,12.7 53.81,6.35 S1.1
  Top 1.016: PIN9.1 U$1.9/CS
  Bottom 0.254: U$1.9/CS 43.43,11.65 R38.1
N$71
  Top 1.016: U$1.10/CS PIN10.1
  Bottom 0.254: U$1.10/CS 45.51,10.16 R39.1
  Bottom 0.508: S2.1 46.19,7.62 43.65,10.16 U$1.10/CS
N$72
  Bottom 0.61: R42.2 M04.1
N$73
  Bottom 0.61: R43.2 3.02,33.02 M05.1
PE  (via drill 0.35)
  other vias: 27.75,78.3 26.5,73.5 25.5,71.5 32.5,27.5 35.5,31.25 89,48 93,48 98,49 96.5,55.5 75,57.25 75.5,50.75 68,39 75.45,23 65.9,31.2 79.5,45.75 66.5,53.25 66.25,44.75 55.5,33 52,30.5 56,29 54,26.5 53,23 49,25 53,48.3 55.5,41.75 47,30.5 51.5,18.5 50,15 45,15.5 61.8,19 62,16.2 62,13.6 63,11 65,20 46.5,9.5 44,8 31,67.5 36.5,70.5 33.5,73 53,62.35 41.1,79.25 56.9,82.65 51.95,76.7 90,73.5 88.5,66.5 71,68.5 43.5,41.75 47,48.25 47.85,78.85 53.5,81.75 53.5,71.5 58.7,73.2 30.75,74.75 28.5,70 48.75,70.75 39,41.75 97.5,23 97.5,29 92.5,29 91,32 11.75,51.5 11.75,45.5 20,49.25 15.5,55 23.75,55 26.5,39.75 34.25,37.75 31,34.75 1.75,55 14.5,59.5 20,59.25 3.75,49.75 9,41.5 30,59.75 91,56 78.75,58 80.5,59.25 85.5,59.75 71,46 74,43.75 77.5,48.75 43,61 46,70 43,73 41,75
  pour Top: 0,88.5 98.5,88.5 100,87 100,68 arc-90 95,63 61,63 arc90 60,62 arc90 61,61 95,61 arc-90 100,56 100,19 78.5,-2.5 22,-2.5 0,19.5 0,56 arc-90 5,61 39,61 arc90 40,62 arc90 39,63 5,63 arc-90 0,68
  pour Bottom: 0,88.5 98.5,88.5 100,87 100,68 arc-90 95,63 61,63 arc90 60,62 arc90 61,61 95,61 arc-90 100,56 100,19 78.5,-2.5 22,-2.5 0,19.5 0,56 arc-90 5,61 39,61 arc90 40,62 arc90 39,63 5,63 arc-90 0,68
RSW1
  Top 1.016: U$1.2 PIN2.1
  Bottom 0.152: 10.25,55 D12.C
  Bottom 0.254: D10.C D16.C 8.05,55 10.25,55 | D12.C 10.25,56 12.12,57.88 21.38,57.88 23.31,59.81 RSA2.1 23.45,59.75 R31.1 30.25,56.4 30.25,39.07 38.34,30.98 39.34,30.98 PIN2.1
RSW2
  Top 1.016: U$1.3/CANTX PIN3.1
  Bottom 0.152: 3.5,54.75 D11.C
  Bottom 0.254: RSA3.1 15.58,58.28 11.96,58.28 9.23,55.55 4.3,55.55 3.5,54.75 1.75,53 1.75,48.28 4.81,45.22 7.13,45.22 R32.1 | R32.1 D17.C | R32.1 8.85,43.5 11.95,43.5 15.99,39.46 21.59,39.46 D14.C 22.98,38.8 23.56,38.22 29.81,38.22 37.84,30.19 37.84,29.94 PIN3.1
RSW3  (via drill 0.35)
  Top 0.254: v38.51,30.2 38.51,26.73 PIN4.1
  Top 1.016: PIN4.1 U$1.4/CANRX
  Bottom 0.152: 10.25,46 D13.C
  Bottom 0.254: RSA5.1 12.86,48.41 D13.C R30.1 10.65,43.95 12.13,43.95 16.16,39.92 23.83,39.92 24.5,39.25 D15.C 29.91,38.8 v38.51,30.2 | D18.C 5.75,46.5 6.25,47 9.75,47 10.25,46.5 10.25,46
RSW4
  Top 0.254: PIN17.1 60.16,15.86 62.83,18.53 62.83,39.91 RSB5.1
  Top 1.016: U$1.17/A3 PIN17.1
  Bottom 0.254: RSB5.1 69.44,49.44 68.5,48.5 68.5,41.85 R33.1 69.8,41.45 D6.C D20.C D8.C
RSW5
  Top 0.152: 76.75,59.75 RSB3.1
  Top 0.254: PIN16.1 63.25,15.79 63.25,36.5 76.75,50 76.75,59.75
  Top 1.016: U$1.16/A2 PIN16.1
  Bottom 0.152: D7.C 97.5,54.5 95,54.5 D19.C | 76.75,59.75 RSB3.1
  Bottom 0.254: 76.75,59.75 78.75,59.75 81.25,57.25 | 81.25,57.25 81.25,55.25 79.5,53.5 69.85,53.5 R35.1 69.6,51.35 D3.C | 95,54.5 92.25,57.25 81.25,57.25
RSW6
  Top 0.254: PIN15.1 60.54,10.16 63.66,13.28 63.66,36.3 77.36,50 79.75,50 82.81,53.06 RSB2.1
  Top 1.016: U$1.15/A1 PIN15.1
  Bottom 0.152: 90,54.25 D4.C 90,54.5 | 92.5,54.5 D9.C 92.5,54.25
  Bottom 0.254: 90,54.25 87.75,52 82.9,52 78.4,47.5 D2.C 69.95,45.6 R34.1 | 90,54.5 92.5,54.5 | 92.5,54.25 93.5,53.25 98.75,53.25 98.75,54.75 94.75,58.75 83.95,58.75 RSB2.1
VIN
  Bottom 0.61: XL1.VIN 93.09,24.09 95,26 95,32 | 95,32 95,34 96.1,35.1 VIN.1 97.8,39.76 C1.+ | C14.2 95,32

### Text on the board
tNames: GND | Teensy 4 / Programmable Effects Pedal / Designed By Joeri Braams | GND | GND
bNames: JLCJLCJLCJLC